# EAGLE design pulseSensor (EAGLE 8.2.2)
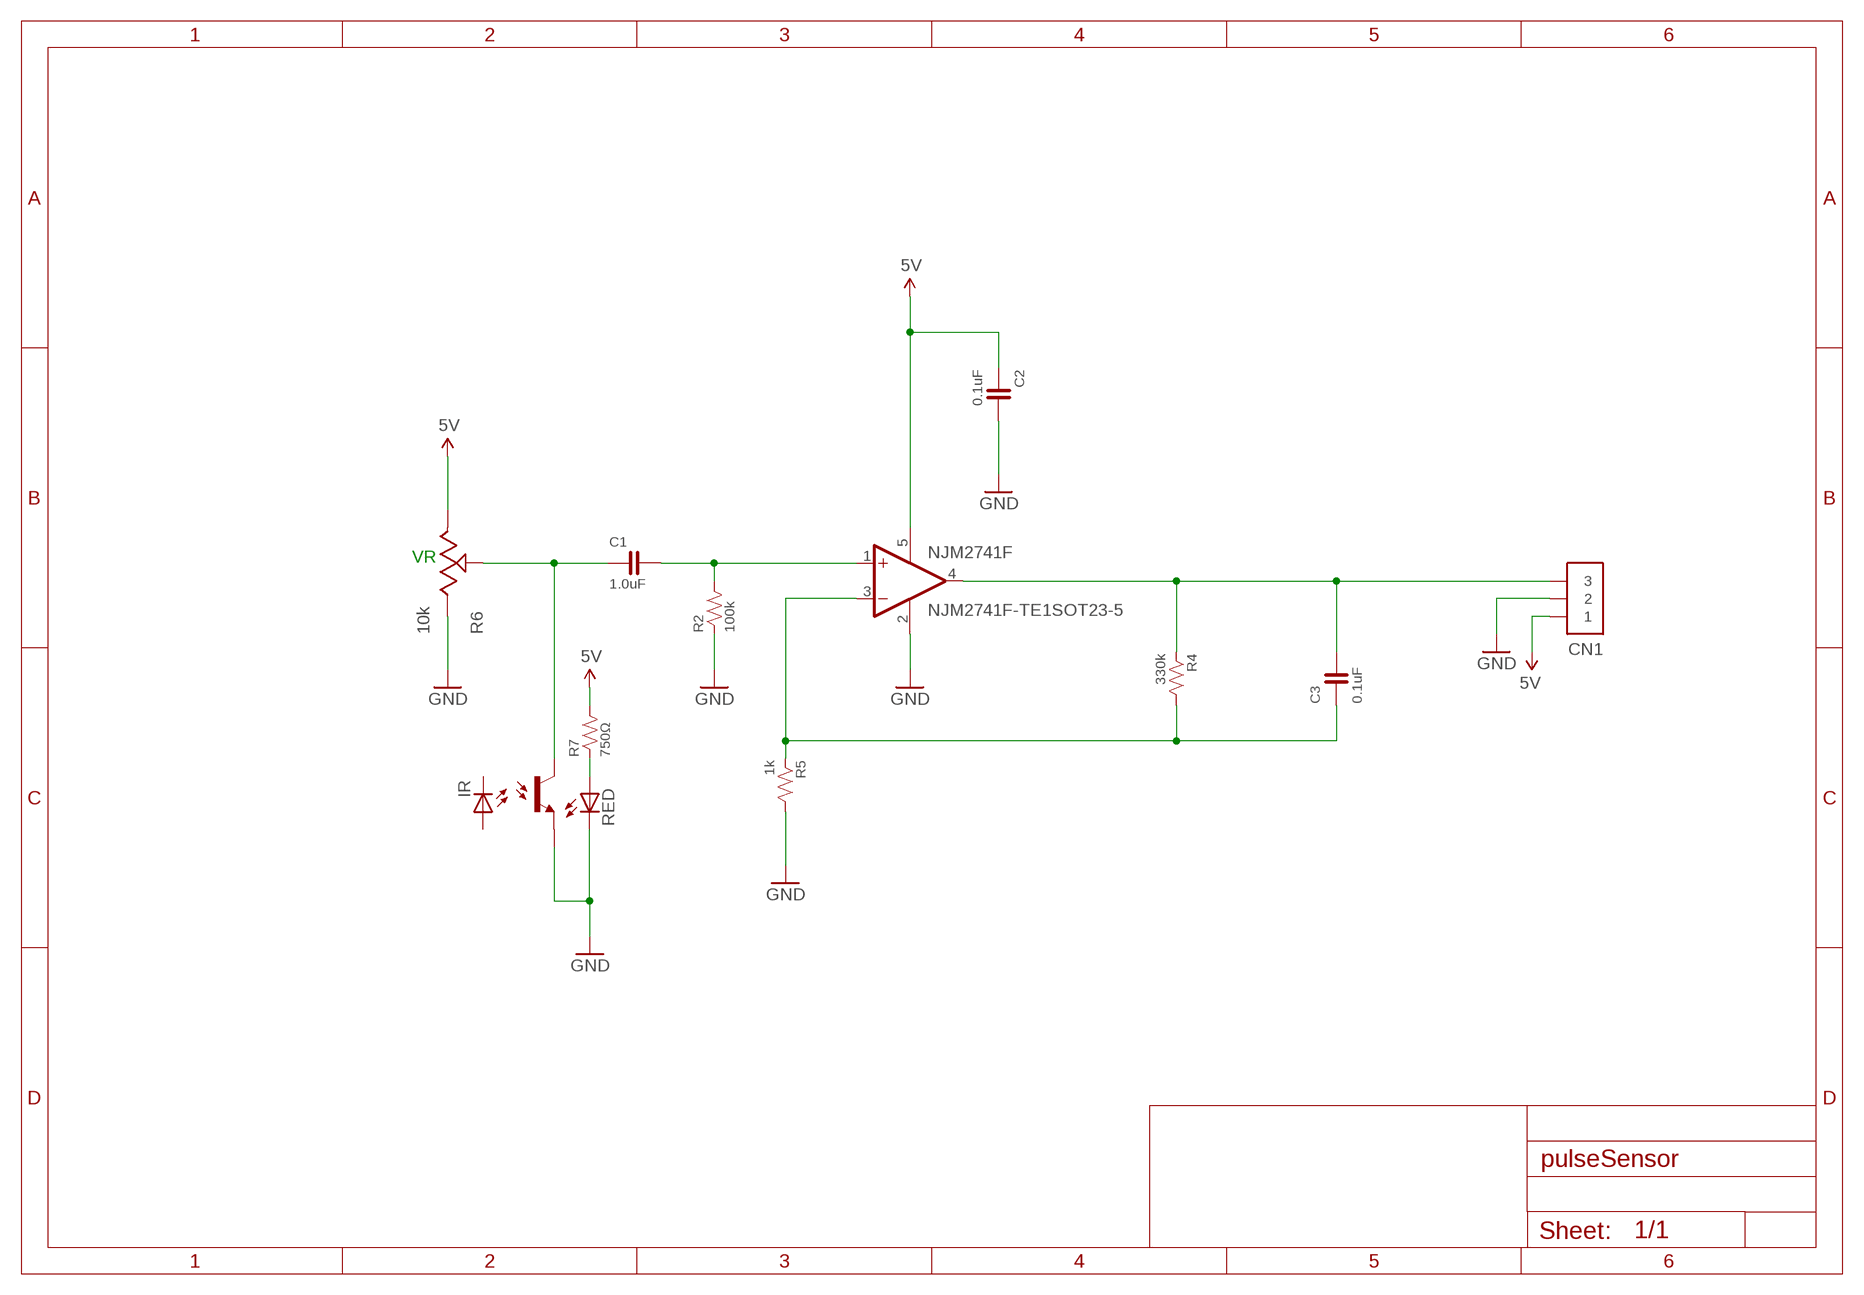
[diagram p0: schematic, sheet 1]

## Parts
C1  1.0uF  CAPACITOR-0603  [0603]
C2  0.1uF  CAPACITOR-0603  [0603]
C3  0.1uF  CAPACITOR-0603  [0603]
CN1  PIN_HEADER_1X3  [PIN_1X3]
NJL1  NJL5501R-TE1  [AA]
NJM2741F1  NJM2741F-TE1SOT23-5  [NJL5501R-PAC]
R2  100k  RESISTOR-0603  [0603]
R4  330k  RESISTOR-0603  [0603]
R5  1k  RESISTOR-0603  [0603]
R6  10k  RESISTOR_VARIABLE-SMD  [TC33X]
R7  750Ω  RESISTOR-0603  [0603]

## Nets
5V: C2.1 CN1.1 NJM2741F1.5(V+) R6.1 R7.2
GND: C2.2 CN1.2 NJM2741F1.2(GND) R2.1 R5.2 R6.3
N$1: C3.2 CN1.3 NJM2741F1.4(OUT) R4.1
N$2: C1.1 NJL1.5 R6.2
N$3: C3.1 NJM2741F1.3(-IN) R4.2 R5.1
N$4: NJL1.1
N$5: NJL1.6 R7.1
N$8: C1.2 NJM2741F1.1(+IN) R2.2
Unconnected: NJL1.2 NJL1.3 NJL1.4

## Notes on the sheet
- VR

## Library data of the parts
C1-C3 = FaBo-Capacitor:CAPACITOR: CAPACITOR
CN1 = FaBo-PIN:PIN_HEADER_1X3
NJL1 = njl5501r:NJL5501R-TE1
NJM2741F1 = NJM2741F-TE1:NJM2741F-TE1
R2 R4 R5 R7 = FaBo-Resistors:RESISTOR: RESISTOR
R6 = FaBo-Resistors:RESISTOR_VARIABLE

## Board
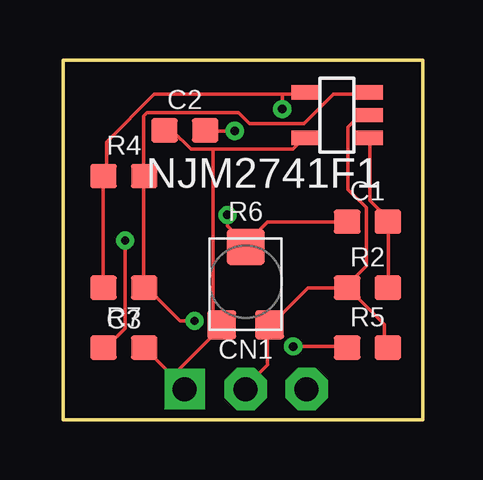
[diagram p1: board, top side]
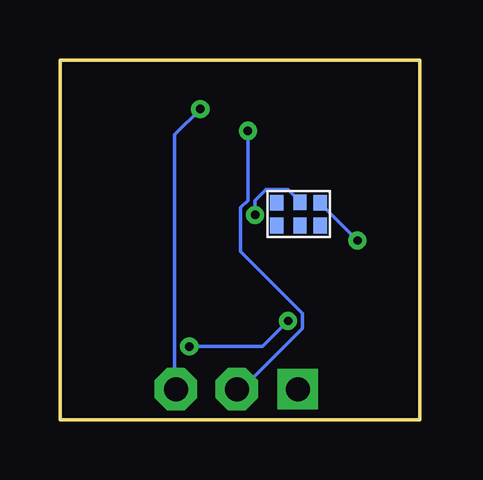
[diagram p2: board, bottom side, seen from below]

Size 15 x 15 mm. Coordinates in mm from the lower left corner, seen from the top.
Outline: 0,0 15,0 15,15 0,15 0,0
Copper layers (1*16): Top 0.035mm / dielectric 1.5mm / Bottom 0.035mm
Design rules "default": minimum track width 6mil, minimum drill 0.35mm, track to track 6mil, track to pad 6mil, pad to pad 6mil, via to via 6mil, smd to smd 6mil, copper to edge 40mil, drill to drill 6mil, minimum pad ring 10mil, minimum via ring 8mil, stop-mask expansion 4mil, vias tented up to drill 0mil, thermal gap 10mil

### Footprints (pad centres in the part's own frame; a part is rotated, then mirrored left to right if it is on the bottom)
0603 = smd 1.1 x 1: 1 -0.85,0; 2 0.85,0
PIN_1X3 = drill 1 pad 1.676 square: 1 -2.54,0 | drill 1 pad 1.778 octagon: 2 0,0; 3 2.54,0
AA = smd 0.55 x 0.65: 1 2.205,0.475; 2 1.355,0.475; 3 0.395,0.475; 4 0.395,1.425; 5 1.356,1.435; 6 2.205,1.425
NJL5501R-PAC = smd 0.6 x 1.2: 1 -0.95,-1.306; 2 0,-1.306; 3 0.95,-1.306; 4 0.95,1.306; 5 -0.95,1.306
TC33X = smd 1.2 x 1.2: 1 -1,-1.8; 3 1,-1.8 | smd 1.6 x 1.5: 2 0,1.45

### Placement (x,y rotation side)
C1  12.7,8.26 0 top
C2  5.08,12.06 0 top
C3  2.54,5.5 180 top
CN1  7.62,1.27 0 top
NJL1  6.35,7.62 0 bottom
NJM2741F1  11.43,12.7 90 top
R2  12.7,5.5 0 top
R4  2.54,10.16 0 top
R5  12.7,3 0 top
R6  7.62,5.75 0 top
R7  2.54,3 0 top

### Tracks (layer width: path | path; a pad name or v marks a point on that pad's centre or on a via)
5V
  Top 0.152: 6.25,11.28 9.6,11.28 10.06,11.73 NJM2741F1.5 | 6.25,11.28 5.33,11.28 4.57,12.04 4.27,12.04 C2.1 | 4.57,1.83 5.03,1.37 CN1.1 4.57,1.83 | 4.57,1.83 3.5,2.9 R7.2 | 4.57,1.83 6.55,3.81 R6.1 6.55,3.96 6.25,4.27 6.25,11.28
GND  (via drill 0.35)
  Top 0.152: R5.2 13.41,3.05 13.41,3.96 11.89,5.49 R2.1 | NJM2741F1.2 12.65,12.65 12.34,12.65 11.89,12.19 11.89,9.6 12.65,8.84 12.65,6.4 11.89,5.64 R2.1 | v7.16,12.04 5.94,12.04 C2.2 | CN1.2 7.62,1.37 8.53,2.29 8.53,3.81 R6.3 8.69,3.96 10.21,5.49 11.73,5.49 R2.1
  Bottom 0.152: v7.16,12.04 7.16,9.14 7.47,8.84 7.47,7.01 4.88,4.42 4.88,3.81 7.32,1.37 7.62,1.37 CN1.2
N$1  (via drill 0.35)
  Top 0.152: C3.2 1.68,5.64 1.68,10.06 R4.1 1.83,10.21 1.83,11.58 3.81,13.56 9.14,13.56 | 9.14,13.56 10.06,13.56 NJM2741F1.4 | 9.14,13.56 v9.14,12.95
  Bottom 0.152: v9.14,12.95 10.21,11.89 10.21,1.37 CN1.3
N$2  (via drill 0.35)
  Top 0.152: v6.86,8.53 6.86,8.08 7.62,7.32 | 7.62,7.32 8.53,8.23 11.73,8.23 C1.1 | 7.62,7.32 R6.2
  Bottom 0.152: v6.86,8.53 6.86,9.14 6.4,9.6 5.49,9.6 5.03,9.14 NJL1.5
N$3  (via drill 0.35)
  Top 0.152: v9.6,3.05 11.73,3.05 R5.1 | v5.49,4.12 4.88,4.12 3.5,5.49 C3.1 3.35,5.64 3.35,10.06 R4.2 3.35,10.21 3.35,12.65 3.5,12.8 7.32,12.8 7.77,12.34 10.06,12.34 11.28,13.56 12.65,13.56 NJM2741F1.3
  Bottom 0.152: v9.6,3.05 6.55,3.05 v5.49,4.12
N$5  (via drill 0.35)
  Top 0.152: v2.59,7.47 2.59,3.81 1.83,3.05 R7.1
  Bottom 0.152: v2.59,7.47 4.12,8.99 NJL1.6
N$8
  Top 0.152: R2.2 13.56,5.64 13.56,8.23 C1.2 13.56,8.38 12.8,9.14 12.8,11.73 NJM2741F1.1